# EAGLE design logic_analyser (EAGLE 7.6.0)
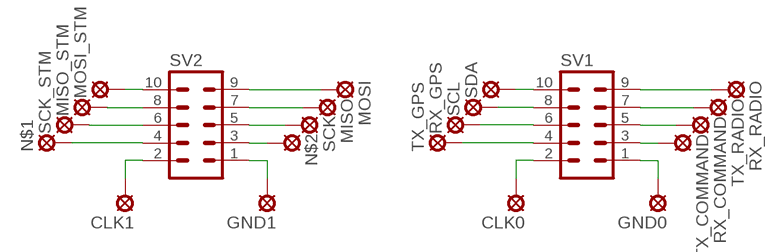
[diagram p0: schematic, sheet 1]

## Parts
CLK0  LSP10  [LSP10]
CLK1  LSP10  [LSP10]
GND0  LSP10  [LSP10]
GND1  LSP10  [LSP10]
MISO  LSP10  [LSP10]
MISO_STM  LSP10  [LSP10]
MOSI  LSP10  [LSP10]
MOSI_STM  LSP10  [LSP10]
N$1  LSP10  [LSP10]
N$2  LSP10  [LSP10]
RX_COMMAND  LSP10  [LSP10]
RX_GPS  LSP10  [LSP10]
RX_RADIO  LSP10  [LSP10]
SCK  LSP10  [LSP10]
SCK_STM  LSP10  [LSP10]
SCL  LSP10  [LSP10]
SDA  LSP10  [LSP10]
SV1  MA05-2  [MA05-2]
SV2  MA05-2  [MA05-2]
TX_COMMAND  LSP10  [LSP10]
TX_GPS  LSP10  [LSP10]
TX_RADIO  LSP10  [LSP10]

## Nets
GND0: GND0.MP SV1.1
GND1: GND1.MP SV2.1
MISO: MISO.MP SV2.7
MISO_STM: MISO_STM.MP SV2.8
MOSI: MOSI.MP SV2.9
MOSI_STM: MOSI_STM.MP SV2.10
N$1: N$1.MP SV2.4
N$2: N$2.MP SV2.3
RX_COMMAND: RX_COMMAND.MP SV1.5
RX_GPS: RX_GPS.MP SV1.6
RX_RADIO: RX_RADIO.MP SV1.9
SCK: SCK.MP SV2.5
SCK0: CLK0.MP SV1.2
SCK1: CLK1.MP SV2.2
SCK_STM: SCK_STM.MP SV2.6
SCL: SCL.MP SV1.8
SDA: SDA.MP SV1.10
TX_COMMAND: SV1.3 TX_COMMAND.MP
TX_GPS: SV1.4 TX_GPS.MP
TX_RADIO: SV1.7 TX_RADIO.MP

## Library data of the parts
CLK0 CLK1 GND0 GND1 MISO MISO_STM MOSI MOSI_STM N$1 N$2 RX_COMMAND RX_GPS RX_RADIO SCK SCK_STM SCL SDA TX_COMMAND TX_GPS TX_RADIO = solpad:LSP10: SOLDER PAD drill 1.0 mm, distributor Buerklin, 12H555
SV1 SV2 = con-lstb:MA05-2: PIN HEADER; OC_FARNELL: unknown; OC_NEWARK: unknown

## Board
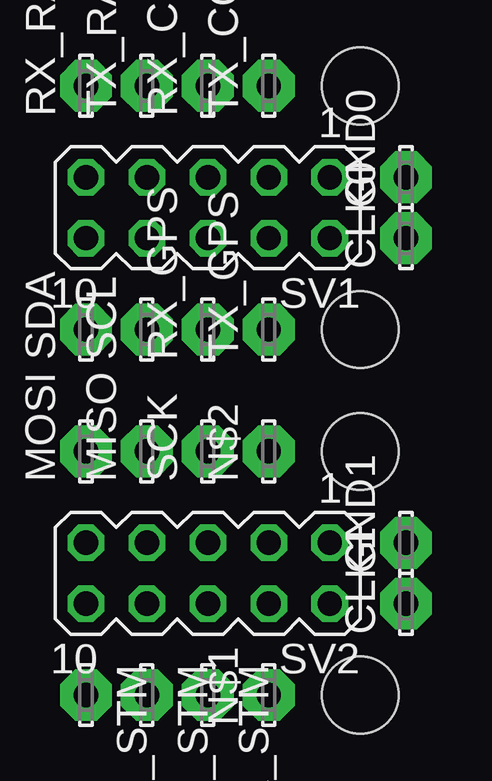
[diagram p1: board, top side]
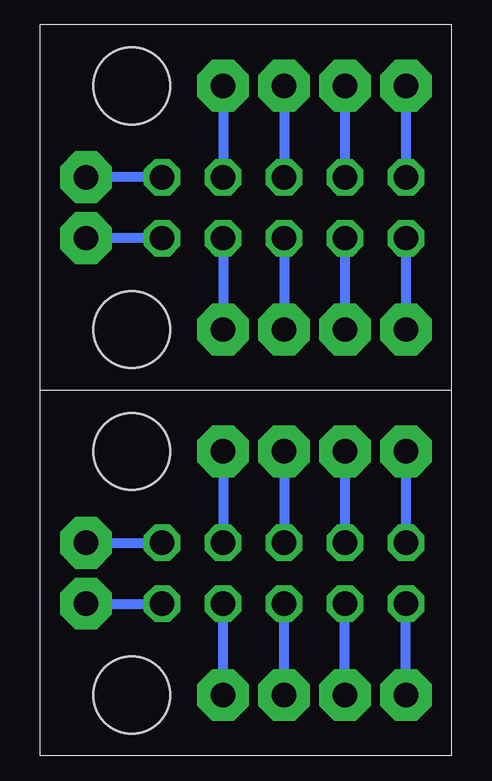
[diagram p2: board, bottom side, seen from below]

No outline drawn. Coordinates in mm, seen from the top.
Copper layers (1*16): Top 0.035mm / dielectric 1.5mm / Bottom 0.035mm
Design rules "default": minimum track width 10mil, minimum drill 24mil, track to track 8mil, track to pad 8mil, pad to pad 8mil, via to via 8mil, smd to smd 8mil, copper to edge 40mil, drill to drill 8mil, minimum pad ring 10mil, minimum via ring 8mil, stop-mask expansion 4mil, vias tented up to drill 0mil, thermal gap 10mil
Holes 3.2 mm at 93.34,4.45 93.34,14.61 93.34,19.68 93.34,29.84

### Footprints (pad centres in the part's own frame; a part is rotated, then mirrored left to right if it is on the bottom)
LSP10 = drill 1.016 pad 2.159 octagon: MP 0,0
MA05-2 = drill 1.016 octagon: 1 -5.08,-1.27; 2 -5.08,1.27; 3 -2.54,-1.27; 4 -2.54,1.27; 5 0,-1.27; 6 0,1.27; 7 2.54,-1.27; 8 2.54,1.27; 9 5.08,-1.27; 10 5.08,1.27

### Placement (x,y rotation side)
CLK0  95.25,23.5 90 top
CLK1  95.25,8.26 90 top
GND0  95.25,26.04 90 top
GND1  95.25,10.79 90 top
MISO  84.45,14.61 90 top
MISO_STM  84.45,4.45 270 top
MOSI  81.92,14.61 90 top
MOSI_STM  81.92,4.45 270 top
N$1  89.53,4.45 90 top
N$2  89.53,14.61 90 top
RX_COMMAND  87,29.84 90 top
RX_GPS  87,19.68 90 top
RX_RADIO  81.92,29.84 90 top
SCK  87,14.61 90 top
SCK_STM  87,4.45 270 top
SCL  84.45,19.68 90 top
SDA  81.92,19.68 90 top
SV1  87,24.77 180 top
SV2  87,9.53 180 top
TX_COMMAND  89.53,29.84 90 top
TX_GPS  89.53,19.68 90 top
TX_RADIO  84.45,29.84 90 top

### Tracks (layer width: path | path; a pad name or v marks a point on that pad's centre or on a via)
GND0
  Bottom 0.406: SV1.1 GND0.MP
GND1
  Bottom 0.406: GND1.MP SV2.1
MISO
  Bottom 0.406: MISO.MP SV2.7
MISO_STM
  Bottom 0.406: MISO_STM.MP SV2.8
MOSI
  Bottom 0.406: MOSI.MP SV2.9
MOSI_STM
  Bottom 0.406: MOSI_STM.MP SV2.10
N$1
  Bottom 0.406: N$1.MP SV2.4
N$2
  Bottom 0.406: N$2.MP SV2.3
RX_COMMAND
  Bottom 0.406: RX_COMMAND.MP SV1.5
RX_GPS
  Bottom 0.406: SV1.6 RX_GPS.MP
RX_RADIO
  Bottom 0.406: RX_RADIO.MP SV1.9
SCK
  Bottom 0.406: SCK.MP SV2.5
SCK0
  Bottom 0.406: SV1.2 CLK0.MP
SCK1
  Bottom 0.406: CLK1.MP SV2.2
SCK_STM
  Bottom 0.406: SCK_STM.MP SV2.6
SCL
  Bottom 0.406: SV1.8 SCL.MP
SDA
  Bottom 0.406: SV1.10 SDA.MP
TX_COMMAND
  Bottom 0.406: TX_COMMAND.MP SV1.3
TX_GPS
  Bottom 0.406: SV1.4 TX_GPS.MP
TX_RADIO
  Bottom 0.406: TX_RADIO.MP SV1.7